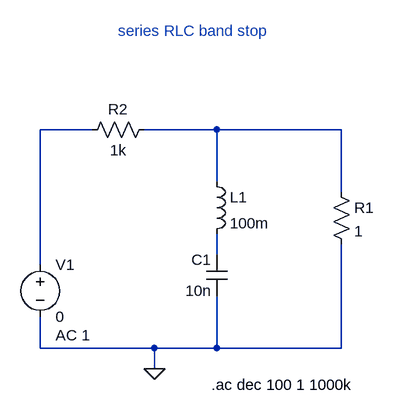
[diagram p0: schematic band_stop_filter2.asc]
band_stop_filter2.asc, the LTspice schematic file:
Version 4
SHEET 1 880 680
WIRE 112 32 32 32
WIRE 304 32 192 32
WIRE 496 32 304 32
WIRE 304 112 304 32
WIRE 496 128 496 32
WIRE 304 224 304 192
WIRE 32 240 32 32
WIRE 32 368 32 320
WIRE 208 368 32 368
WIRE 304 368 304 288
WIRE 304 368 208 368
WIRE 496 368 496 208
WIRE 496 368 304 368
WIRE 208 400 208 368
FLAG 208 400 0
SYMBOL voltage 32 224 R0
WINDOW 123 24 124 Left 2
WINDOW 39 0 0 Left 0
SYMATTR InstName V1
SYMATTR Value 0
SYMATTR Value2 AC 1
SYMBOL cap 320 288 R180
WINDOW 0 24 56 Left 2
WINDOW 3 24 8 Left 2
SYMATTR InstName C1
SYMATTR Value 10n
SYMBOL ind 288 96 R0
SYMATTR InstName L1
SYMATTR Value 100m
SYMBOL res 96 48 R270
WINDOW 0 32 56 VTop 2
WINDOW 3 0 56 VBottom 2
SYMATTR InstName R2
SYMATTR Value 1k
SYMBOL res 480 112 R0
SYMATTR InstName R1
SYMATTR Value 1
TEXT 296 424 Left 2 !.ac dec 100 1 1000k
TEXT 152 -120 Left 2 ;series RLC band stop

The netlist it stands for:
* band_stop_filter2.asc
V1 N001 0 0 AC 1
C1 0 N003 10n
L1 N002 N003 100m
R2 N001 N002 1k
R1 N002 0 1
.ac dec 100 1 1000k
* series RLC band stop
.backanno
.end